# Altium project InvestiGator.PrjPCB
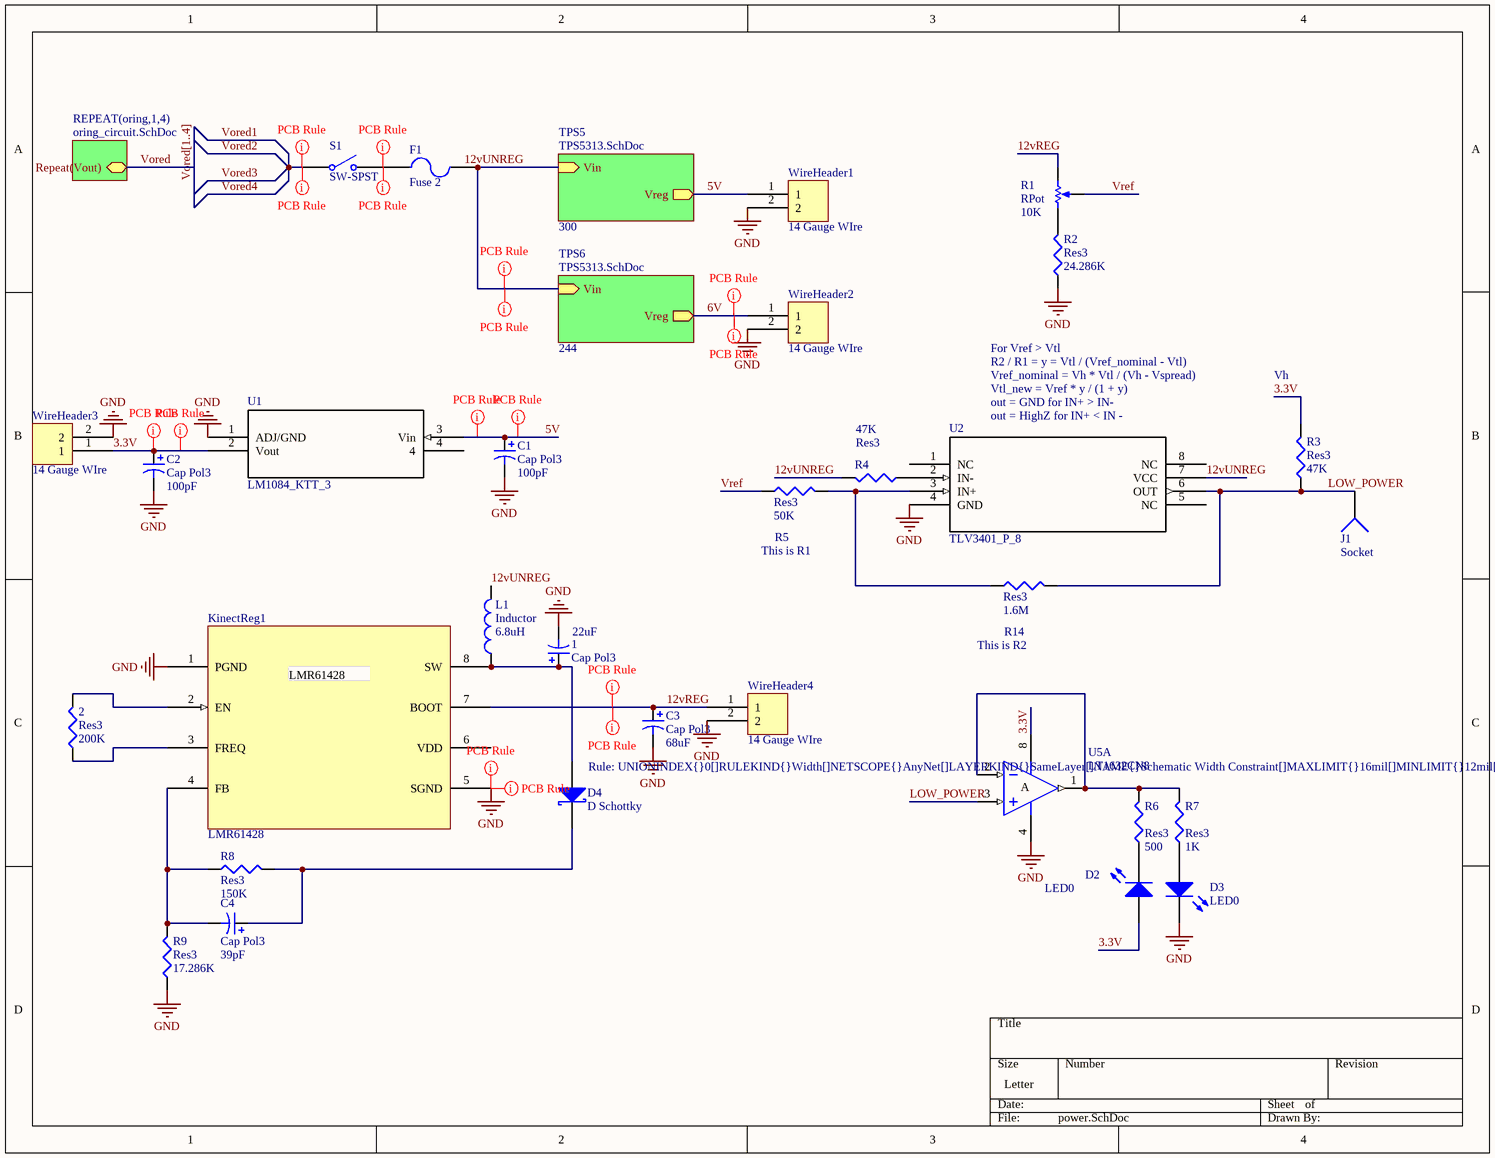
[diagram p0: power.SchDoc]
3 sheets, 85 parts. Net scope: hierarchical (ports join the sheet entries above them; power ports are global).
Board file: InvestiGator.PcbDoc
Sheets:
  power.SchDoc
    oring1 = oring_circuit.SchDoc
    oring2 = oring_circuit.SchDoc
    oring3 = oring_circuit.SchDoc
    oring4 = oring_circuit.SchDoc
    TPS5 = TPS5313.SchDoc
    TPS6 = TPS5313.SchDoc

## Sheet power.SchDoc
size Letter

### Parts
1  Cap Pol3  value 22uF  [C0805]
2  Res3  value 200K  [6-0805_M]
C1  Cap Pol3  value 100pF  [C0805]
C2  Cap Pol3  value 100pF  [C0805]
C3  Cap Pol3  value 68uF  [C0805]
C4  Cap Pol3  value 39pF  [C0805]
D2  LED0  [LED-0]
D3  LED0  [LED-0]
D4  D Schottky  [AXIAL-0.3]
F1  Fuse 2  [PIN-W2/E2.8]
J1  Socket  [PIN1]
KinectReg1  LMR61428  [D8]
L1  Inductor  value 6.8uH  [6-0805_L]
R1  RPot  value 10K  [RPot]
R2  Res3  value 24.286K  [6-0805_M]
R3  Res3  value 47K  [6-0805_M]
R4  Res3  value 47K  [6-0805_M]
R5  Res3  value 50K  [6-0805_M]
R6  Res3  value 500  [6-0805_M]
R7  Res3  value 1K  [6-0805_M]
R8  Res3  value 150K  [6-0805_M]
R9  Res3  value 17.286K  [6-0805_M]
R14  Res3  value 1.6M  [6-0805_M]
S1  SW-SPST  [switch]
U1  LM1084_KTT_3  [TS3B]
U2  TLV3401_P_8  [P8]
U5  LT1632CN8  [P8]  (part A of 2)
WireHeader1  14 Gauge WIre  [WireHeader]
WireHeader2  14 Gauge WIre  [WireHeader]
WireHeader3  14 Gauge WIre  [WireHeader]
WireHeader4  14 Gauge WIre  [WireHeader]

### Sub-sheets
REPEAT(oring,1,4) = oring_circuit.SchDoc: Repeat(Vout)
TPS5 = TPS5313.SchDoc: Vreg (out), Vin (in)  | R2_Value: 300
TPS6 = TPS5313.SchDoc: Vreg (out), Vin (in)  | R2_Value: 244

### Nets
GND: 1.2 C1.2 C2.2 C3.2 D3.2(K) KinectReg1.1(PGND) KinectReg1.5(SGND) R2.1 R9.1 U1.1(ADJ/GND) U2.4(GND) U5.4(V-) WireHeader1.2 WireHeader2.2 WireHeader3.2 WireHeader4.2
3.3V: C2.1 D2.1(A) R3.2 U1.2(Vout) U5.8(V+) WireHeader3.1
5V: C1.1 U1.3(Vin) WireHeader1.1 ; sheet TPS5/Vreg
6V: WireHeader2.1 ; sheet TPS6/Vreg
12vREG: C3.1 KinectReg1.7(BOOT) R1.2(BOT) WireHeader4.1
12vUNREG: L1.2 R4.2 U2.7(VCC)
LOW_POWER: J1.1 R3.1 R14.2 U2.6(OUT) U5.3(IN+)
Vored: sheet REPEAT(oring,1,4)/Repeat(Vout)
Vored1: S1.1(COMMON)  [also labelled Vored2, Vored3, Vored4]
Vref: R1.3(TAP) R5.1
Net1_1: 1.1 D4.1(A) KinectReg1.8(SW) L1.1
Net2_1: 2.1 KinectReg1.3(FREQ)
Net2_2: 2.2 KinectReg1.2(EN)
Net*_TPS5_3: F1.2 ; sheet TPS5/Vin, sheet TPS6/Vin
NetC4_1: C4.1 D4.2(K) R8.2
NetC4_2: C4.2 KinectReg1.4(FB) R8.1 R9.2
NetD2_2: D2.2(K) R6.1
NetD3_1: D3.1(A) R7.1
NetF1_1: F1.1 S1.2(NO)
NetR1_1: R1.1(TOP) R2.2
NetR4_1: R4.1 U2.2(IN-)
NetR5_2: R5.2 R14.1 U2.3(IN+)
NetR6_2: R6.2 R7.2 U5.1(OUT) U5.2(IN-)

Not connected (* = marked no-connect by the designer): KinectReg1 6(VDD); U1 4; U2 1(NC) 5(NC) 8(NC)

### Buses and harness runs
bus Vored[1..4]

### Layout directives
rule Width Constraint [Pref Width = 15mil    Min Width = 12mil    Max Width = 16mil]: 12vREG
rule Undefined; rule Width Constraint [Pref Width = 30mil    Min Width = 30mil    Max Width = 30mil]: 3.3V
rule Width Constraint [Pref Width = 40mil    Min Width = 40mil    Max Width = 40mil]: 5V, 6V, Net*_TPS5_3, NetF1_1, Vored1
rule Width Constraint [Pref Width = 15mil    Min Width = 15mil    Max Width = 15mil]: GND
rule Undefined; rule Clearance Constraint [Clearance = 30mil]: 3.3V, 5V, 6V, 12vREG, GND, Net*_TPS5_3, NetF1_1, Vored1

### Notes on the sheet
- R2 / R1 = y = Vtl / (Vref_nominal - Vtl)
- For Vref > Vtl
- out = GND for IN+ > IN-
- (near U2) out = HighZ for IN+ < IN -
- Vtl_new = Vref * y / (1 + y)
- Vref_nominal = Vh * Vtl / (Vh - Vspread)
- Vh
- This is R1
- This is R2
- Labels drawn without touching a wire or pin: 12vUNREG
- (in symbol LT1632CN8, part A) A

### Library data of the parts
1 C1-C4 = Cap Pol3: Polarized Capacitor (Surface Mount); Published: 8-Jun-2000; LatestRevisionDate: 29-May-2009; LatestRevisionNote: IPC-7351 Footprint Added.; PackageReference: C0805; Publisher: Altium Limited; PackageDescription: Chip Capacitor
2 R2-R9 R14 = Res3: Resistor; Published: 8-Jun-2000; LatestRevisionDate: 29-May-2009; LatestRevisionNote: IPC-7351 Footprint Added.; PackageReference: J1-0603; Publisher: Altium Limited; PackageDescription: Chip Resistor
D2 D3 = LED0: Typical INFRARED GaAs LED; Published: 8-Jun-2000; LatestRevisionDate: 08-Jul-2005; LatestRevisionNote: Mech Layer 1 removed.; PackageReference: LED-0; Publisher: Altium Limited; PackageDescription: LED; 2 Leads
D4 = D Schottky: Schottky Diode; Published: 8-Jun-2000; LatestRevisionDate: 17-Jul-2002; LatestRevisionNote: Re-released for DXP Platform.; PackageReference: SMB; Publisher: Altium Limited; PackageDescription: DO-214-AA/SMB; 2 C-Bend Leads; Body 5.3 x 3.6 mm, inc. leads (LxW); Code_JEDEC: DO-214-AA
F1 = Fuse 2: Fuse; Published: 8-Jun-2000; LatestRevisionDate: 17-Jul-2002; LatestRevisionNote: Re-released for DXP Platform.; PackageReference: PIN-W2/E2.8; Publisher: Altium Limited; PackageDescription: Thru-Hole; 2 Leads
L1 = Inductor: Code_IEC: 1005; Published: 8-Jun-2000; LatestRevisionDate: 29-May-2009; LatestRevisionNote: IPC-7351 Footprint Added.; PackageReference: 0402-A; Publisher: Altium Limited; PackageDescription: Chip Inductor; Code_JEITA: 0402
R1 = RPot: Potentiometer; Sim Note: Enter the Resistance value and the set point into parameter fields.; Set Position: 0.5; Published: 8-Jun-2000; LatestRevisionDate: 17-Jul-2002; LatestRevisionNote: Re-released for DXP Platform.; PackageReference: VR5; Publisher: Altium Limited; PackageDescription: Variable Resistor, Thru-Hole; 3 Leads
S1 = SW-SPST: Single-Pole, Single-Throw Switch; Published: 24-Mar-1999; LatestRevisionDate: 17-Jul-2002; LatestRevisionNote: Re-released for DXP Platform.; PackageReference: SPST-2; Publisher: Altium Limited; PackageDescription: Switch; 2 Leads
U1 = LM1084_KTT_3: Imported; PartNumber: LM1084IS-33; Comp: TypeLDO; Vendor: NationalSemiconductor; base_pn: LM1084; Symbol: NameLM1084IS-33; Library: ReferenceLM1084IS; Type: DEV; Version: 1; Pin: Count3; RefDes: RefDes; Value: Value
U2 = TLV3401_P_8: Imported; Vendor: Texas Instruments; PACKAGE_DESIGNATOR: P; PIN_COUNT: 8; FAMILY_NAME: COMPARATOR; INDUSTRY_STD_PKG_TYPE: PDIP; Manufacturer_Part_Number: tlv3401_p_8; GENERIC_PART_NUMBER: TLV3401; Datasheet URL: http://www.ti.com/lit/gpn/TLV3401; Manufacturer: Texas Instruments; RefDes: RefDes; Type: DEV; Value: Value
U5 = LT1632CN8: 45MHz, 45V/µs, Dual Rail-to-Rail Input and Output Precision Operational Amplifier; Note: 1455; Published: 8-Jun-2000; LatestRevisionDate: 29-May-2009; LatestRevisionNote: Component Body Added.; DatasheetVersion: 1996; PackageVersion: N8 1002; PackageReference: N8; Publisher: Altium Limited; PackageDescription: DIP, Plastic, 8-Pin, Row Spacing 7.62 mm, Pitch 2.54 mm; ComponentLink1Description: Manufacturer Link; ComponentLink1URL: http://www.linear.com/; ComponentLink2Description: Datasheet; ComponentLink2URL: http://www.linear.com/pc/downloadDocument.do?navId=H0,C1,C1154,C1009,C1022,P1642,D3055
WireHeader1-WireHeader4 = WireHeader
J1 = Socket: LatestRevisionDate: 17-Jul-2002; LatestRevisionNote: Re-released for DXP Platform.; Publisher: Altium Limited

## Sheet oring_circuit.SchDoc
size Letter
Used 4 times, as channels oring1, oring2, oring3, oring4. Parts and nets are listed once, with the designators drawn on the sheet.
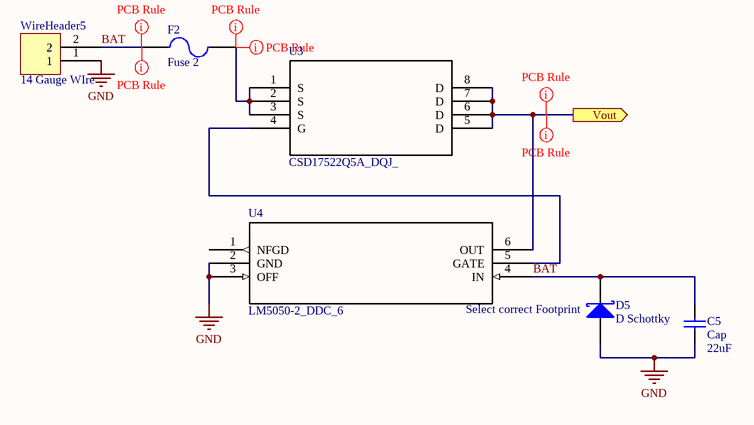
[diagram p1: oring_circuit.SchDoc]

### Parts
C5  Cap  value 22uF  [C0805]
D5  D Schottky  [AXIAL-0.3]
F2  Fuse 2  [PIN-W2/E2.8]
U3  CSD17522Q5A_DQJ_  [DQJ8]
U4  LM5050-2_DDC_6  [MK06A]
WireHeader5  14 Gauge WIre  [WireHeader]

### Ports
Vout (out)

### Nets
GND: C5.1 D5.1(A) U4.2(GND) U4.3(OFF) WireHeader5.1
BAT: C5.2 D5.2(K) F2.1 U4.4(IN) WireHeader5.2
Vout: U3.5(D) U3.6(D) U3.7(D) U3.8(D) U4.6(OUT) ; port Vout
NetF2_2: F2.2 U3.1(S) U3.2(S) U3.3(S)
NetU3_4: U3.4(G) U4.5(GATE)

Not connected (* = marked no-connect by the designer): U4 1(NFGD)

### Channels
oring1: designators end in _oringA; ports Vout=Vored1
oring2: designators end in _oringB; ports Vout=Vored1
oring3: designators end in _oringC; ports Vout=Vored1
oring4: designators end in _oringD; ports Vout=Vored1

### Layout directives
rule Width Constraint [Pref Width = 40mil    Min Width = 40mil    Max Width = 40mil]: BAT_oring1, NetF2_oringA_2, Vored1
rule Undefined; rule Clearance Constraint [Clearance = 30mil]: BAT_oring1, NetF2_oringA_2, Vored1

### Notes on the sheet
- (near D5) Select correct Footprint

### Library data of the parts
C5 = Cap: Capacitor; Published: 8-Jun-2000; LatestRevisionDate: 17-Jul-2002; LatestRevisionNote: Re-released for DXP Platform.; PackageReference: RAD-0.3; Publisher: Altium Limited; PackageDescription: Radial Cap, Thru-Hole; 2 Leads; 0.3 in Pin Spacing
D5 = D Schottky: Schottky Diode; Published: 8-Jun-2000; LatestRevisionDate: 17-Jul-2002; LatestRevisionNote: Re-released for DXP Platform.; PackageReference: SMB; Publisher: Altium Limited; PackageDescription: DO-214-AA/SMB; 2 C-Bend Leads; Body 5.3 x 3.6 mm, inc. leads (LxW); Code_JEDEC: DO-214-AA
F2 = Fuse 2: Fuse; Published: 8-Jun-2000; LatestRevisionDate: 17-Jul-2002; LatestRevisionNote: Re-released for DXP Platform.; PackageReference: PIN-W2/E2.8; Publisher: Altium Limited; PackageDescription: Thru-Hole; 2 Leads
U3 = CSD17522Q5A_DQJ_: Imported; Manufacturer: Texas Instruments; INDUSTRY_STD_PKG_TYPE: SON; FAMILY_NAME: N-Channel MOSFET Transistors; PIN_COUNT: 8; PACKAGE_DESIGNATOR: DQJ; Datasheet URL: http://www.ti.com/lit/gpn/CSD17522Q5A; GENERIC_PART_NUMBER: CSD17522Q5A; RefDes: RefDes; Type: DEV; Value: Value
U4 = LM5050-2_DDC_6: Imported; Manufacturer: Texas Instruments; DatasheetURL: http://www.ti.com/lit/ds/symlink/lm5050-2.pdf; basePN: LM5050-2; NSC_PackageReference: MK06A; Manufacturer_Part_Number: lm5050-2_ddc_6; Vendor: Texas Instruments; RefDes: RefDes; Type: DEV; Value: Value
WireHeader5 = WireHeader

## Sheet TPS5313.SchDoc
size Letter
Used 2 times, as channels TPS5, TPS6. Parts and nets are listed once, with the designators drawn on the sheet.
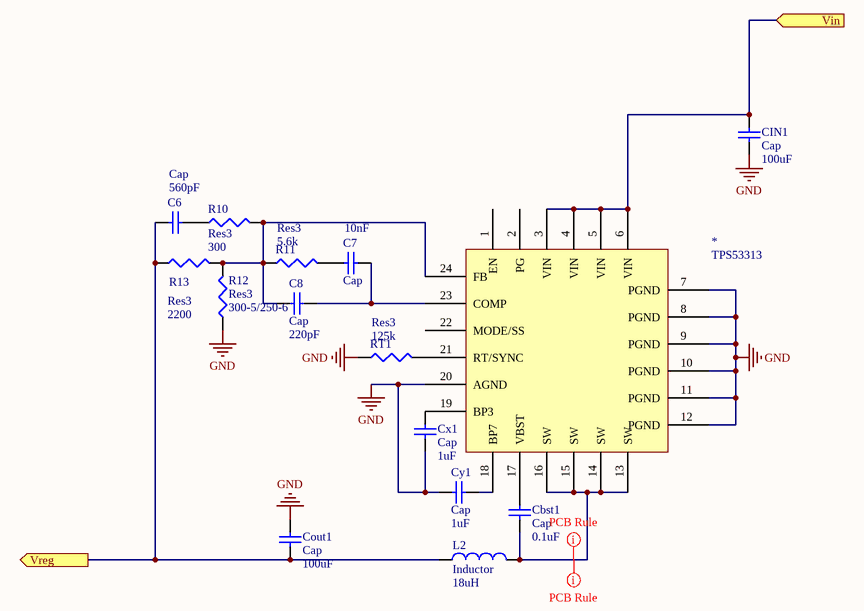
[diagram p2: TPS5313.SchDoc]

### Parts
*  TPS53313  [RGE24_2P45X2P45]
C6  Cap  value 560pF  [C0805]
C7  Cap  value 10nF  [C0805]
C8  Cap  value 220pF  [C0805]
Cbst1  Cap  value 0.1uF  [C0805]
CIN1  Cap  value 100uF  [C0805]
Cout1  Cap  value 100uF  [C0805]
Cx1  Cap  value 1uF  [C0805]
Cy1  Cap  value 1uF  [C0805]
L2  Inductor  value 18uH  [6-0805_L]
R10  Res3  value 300  [6-0805_M]
R11  Res3  value 5.6k  [6-0805_M]
R12  Res3  value 300-5/250-6  [6-0805_M]
R13  Res3  value 2200  [6-0805_M]
RT1  Res3  value 125k  [6-0805_M]

### Ports
Vin (in), Vreg (out)

### Nets
GND: *.7(PGND) *.8(PGND) *.9(PGND) *.10(PGND) *.11(PGND) *.12(PGND) *.20(AGND) CIN1.2 Cout1.2 Cx1.1 Cy1.2 R12.1 RT1.1
Vin: *.3(VIN) *.4(VIN) *.5(VIN) *.6(VIN) CIN1.1 ; port Vin
Vreg: C6.1 Cout1.1 L2.1 R13.1 ; port Vreg
Net*_13: *.13(SW) *.14(SW) *.15(SW) *.16(SW) Cbst1.1 L2.2
Net*_17: *.17(VBST) Cbst1.2
Net*_18: *.18(BP7) Cy1.1
Net*_19: *.19(BP3) Cx1.2
Net*_21: *.21(RT/SYNC) RT1.2
Net*_23: *.23(COMP) C7.2 C8.2
Net*_24: *.24(FB) C8.1 R10.2 R11.1 R12.2 R13.2
NetC6_2: C6.2 R10.1
NetC7_1: C7.1 R11.2

Not connected (* = marked no-connect by the designer): * 1(EN) 2(PG) 22(MODE/SS)

### Channels
TPS5: designators end in _TPS5; ports Vin=Net*_TPS5_3 Vreg=5V
TPS6: designators end in _TPS6; ports Vin=Net*_TPS5_3 Vreg=6V

### Layout directives
rule Width Constraint [Pref Width = 40mil    Min Width = 40mil    Max Width = 40mil]: Net*_TPS5_13
rule Undefined; rule Clearance Constraint [Clearance = 30mil]: Net*_TPS5_13

### Library data of the parts
C6-C8 Cbst1 CIN1 Cout1 Cx1 Cy1 = Cap: Capacitor; Published: 8-Jun-2000; LatestRevisionDate: 17-Jul-2002; LatestRevisionNote: Re-released for DXP Platform.; PackageReference: RAD-0.3; Publisher: Altium Limited; PackageDescription: Radial Cap, Thru-Hole; 2 Leads; 0.3 in Pin Spacing
L2 = Inductor: Code_IEC: 1005; Published: 8-Jun-2000; LatestRevisionDate: 29-May-2009; LatestRevisionNote: IPC-7351 Footprint Added.; PackageReference: 0402-A; Publisher: Altium Limited; PackageDescription: Chip Inductor; Code_JEITA: 0402
R10-R13 RT1 = Res3: Resistor; Published: 8-Jun-2000; LatestRevisionDate: 29-May-2009; LatestRevisionNote: IPC-7351 Footprint Added.; PackageReference: J1-0603; Publisher: Altium Limited; PackageDescription: Chip Resistor

## Nets that join several sheets
GND: power (16 pins), oring1 (5 pins), oring2 (5 pins), oring3 (5 pins), oring4 (5 pins), TPS5 (13 pins), TPS6 (13 pins)
5V: power (C1.1 U1.3 WireHeader1.1), TPS5 (C6_TPS5.1 Cout1_TPS5.1 L2_TPS5.1 R13_TPS5.1)
6V: power (WireHeader2.1), TPS6 (C6_TPS6.1 Cout1_TPS6.1 L2_TPS6.1 R13_TPS6.1)
Net*_TPS5_3: power (F1.2), TPS5 (5 pins), TPS6 (5 pins)
Vored1: power (S1.1), oring1 (5 pins), oring2 (5 pins), oring3 (5 pins), oring4 (5 pins)